# EAGLE design SOT-23_to_breadboard (EAGLE 8.5.1)
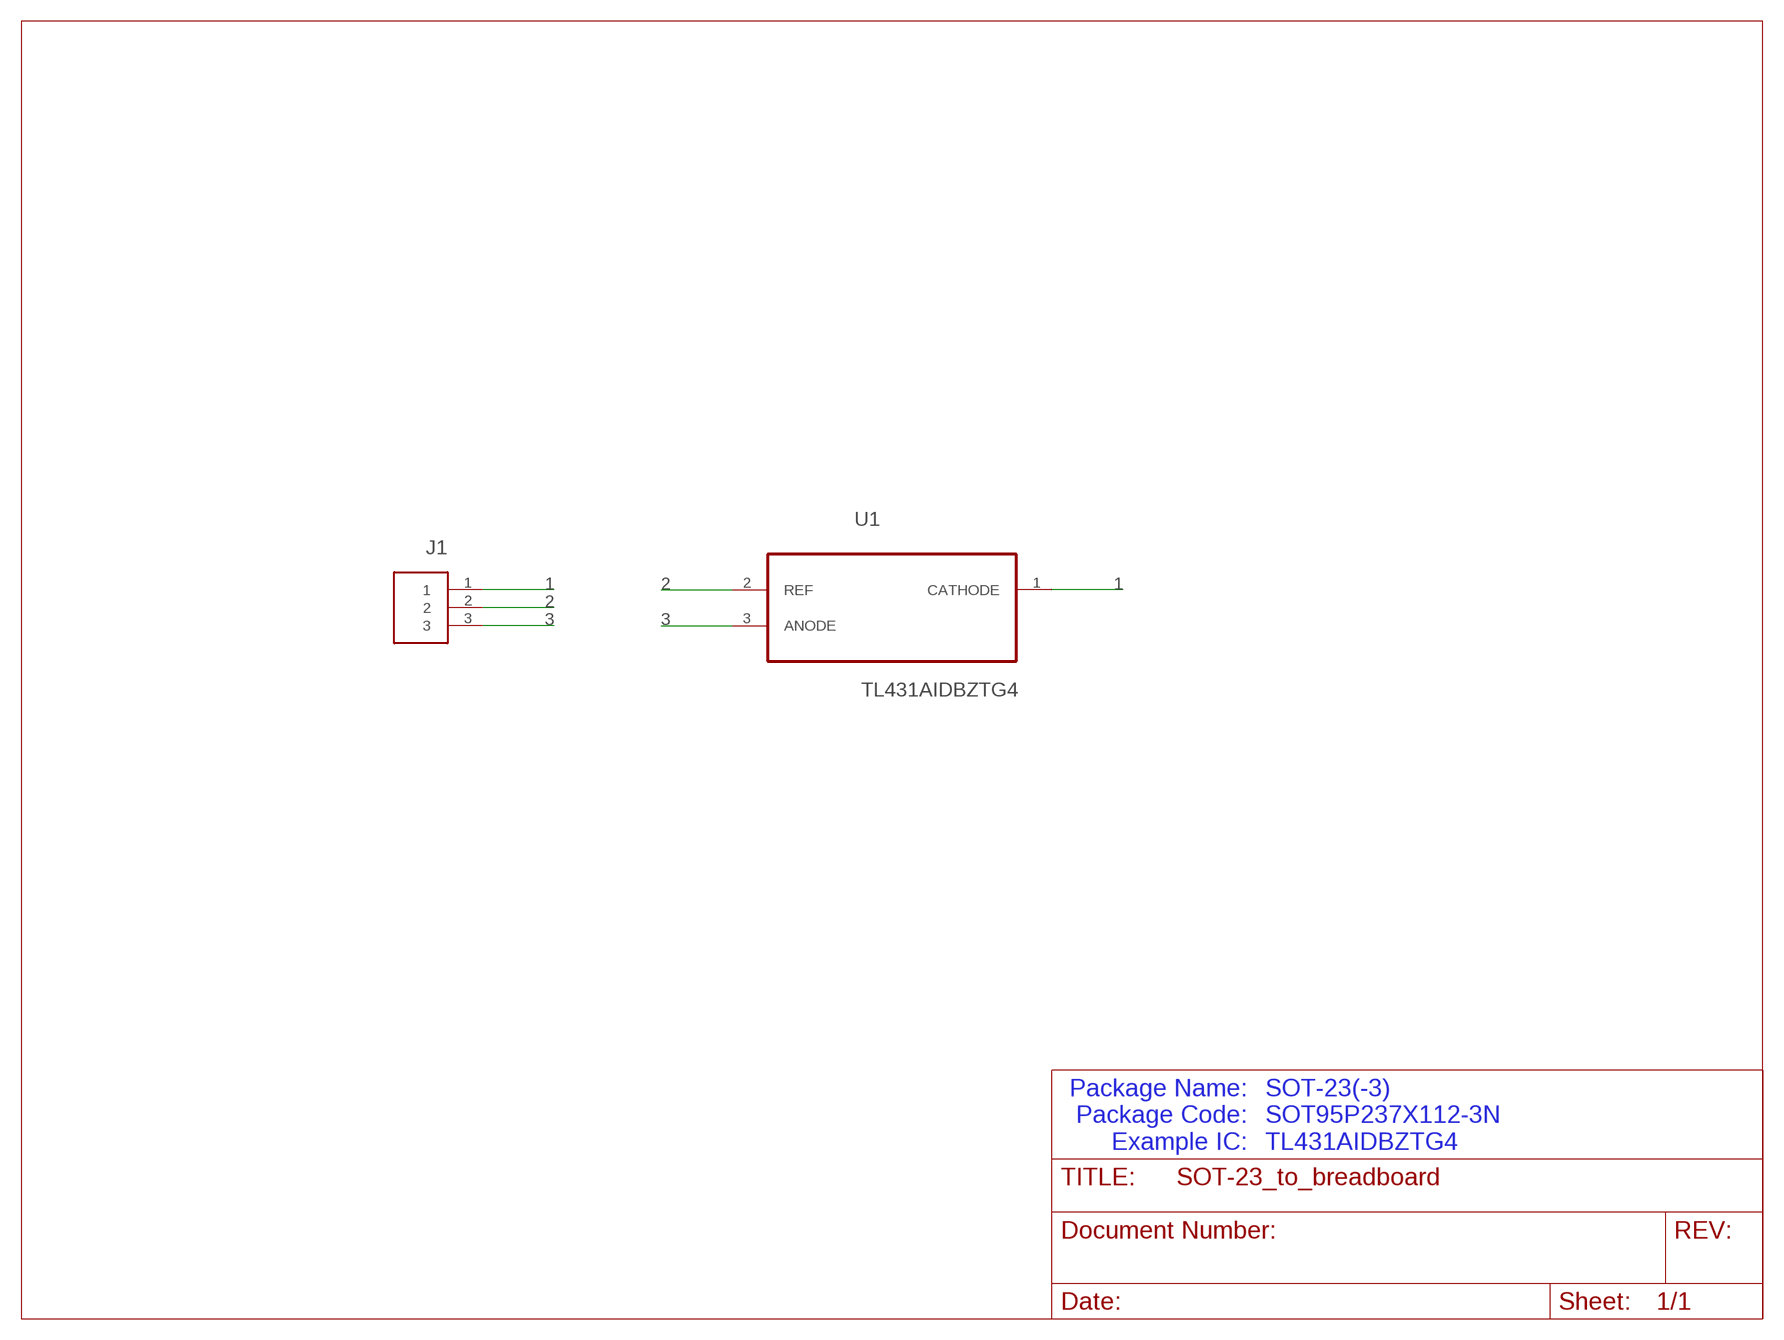
[diagram p0: schematic, sheet 1]

## Parts
J1  CONNECTOR_3  [68000-103HLF]
U1  TL431AIDBZTG4  [SOT95P237X112-3N]

## Nets
1: J1.1 U1.1(CATHODE)
2: J1.2 U1.2(REF)
3: J1.3 U1.3(ANODE)

## Notes on the sheet
- Package Name:
  Package Code:
  Example IC:
- SOT-23(-3)
  SOT95P237X112-3N
  TL431AIDBZTG4

## Library data of the parts
J1 = SnapEDA:CONNECTOR_3
U1 = SnapEDA:TL431AIDBZTG4: PRECISION PROGRAMMABLE REFERENCE; AVAILABILITY: Good; DESCRIPTION: V-Ref Adjustable 2.495V to 36V 100mA Automotive 3-Pin SOT-23 T/R; MF: Texas Instruments; MP: TL431AIDBZTG4; PACKAGE: SOT-23-3 Texas Instruments; PRICE: 0.37 USD

## Board
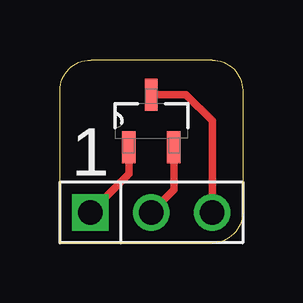
[diagram p1: board, top side]
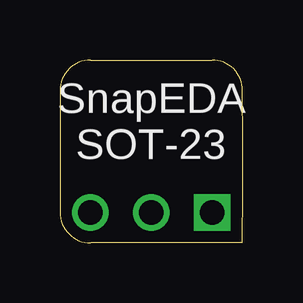
[diagram p2: board, bottom side, seen from below]

Size 7.63 x 7.62 mm. Coordinates in mm from the lower left corner, seen from the top.
Outline: 1.3,7.62 6.36,7.62 arc-90 7.63,6.35 arc0 7.63,1.27 arc-90 6.36,0
Outline: 6.34,0 0.01,0 arc0 0.01,6.35 arc-90 1.28,7.62
Copper layers (1*16): Top 0.035559375mm / dielectric 1.6mm / Bottom 0.035559375mm
Design rules "oshpark-2layer": minimum track width 6mil, minimum drill 10mil, track to track 6mil, track to pad 6mil, pad to pad 6mil, via to via 6mil, smd to smd 6mil, copper to edge 15mil, drill to drill 6mil, minimum pad ring 5mil, minimum via ring 5mil, stop-mask expansion 2.5mil, vias tented up to drill 0mil, thermal gap 10mil

### Footprints (pad centres in the part's own frame; a part is rotated, then mirrored left to right if it is on the bottom)
68000-103HLF = drill 1.016 square: 1 0,0 | drill 1.016: 2 2.54,0; 3 5.08,0
SOT95P237X112-3N = smd 1.321 x 0.559: 1 -1.092,0.94; 2 -1.092,-0.94 | smd 1.321 x 0.508: 3 1.092,0

### Placement (x,y rotation side)
J1  1.28,1.27 0 top
U1  3.82,5.08 90 top

### Tracks (layer width: path | path; a pad name or v marks a point on that pad's centre or on a via)
1
  Top 0.305: U1.1 2.88,2.87 J1.1
2
  Top 0.305: U1.2 4.76,2.21 J1.2
3
  Top 0.305: U1.3 5.26,6.17 6.36,5.08 J1.3

### Text on the board
tPlace: 1
bPlace: SnapEDA / SOT-23